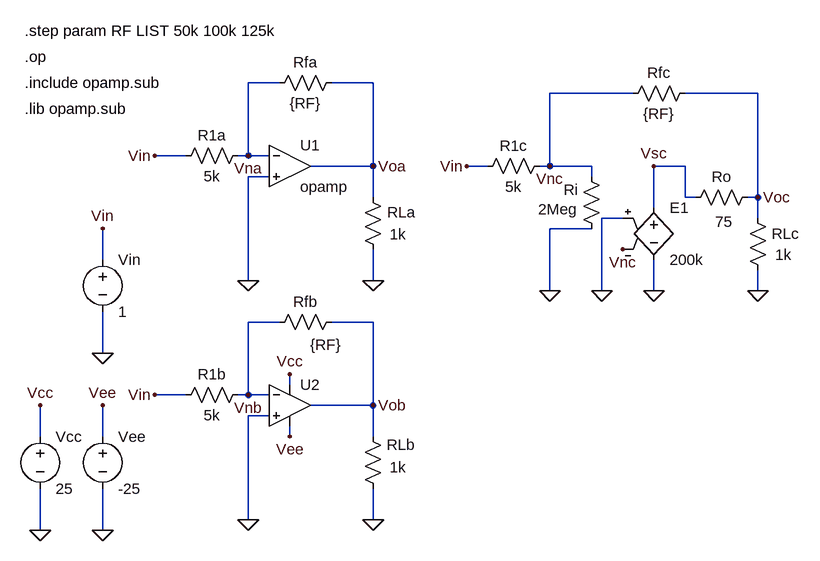
[diagram p0: schematic lab7.asc]
lab7.asc, the LTspice schematic file:
Version 4
SHEET 1 1268 680
WIRE 368 -64 320 -64
WIRE 512 -64 448 -64
WIRE 912 -48 784 -48
WIRE 1104 -48 992 -48
WIRE 224 48 176 48
WIRE 320 48 320 -64
WIRE 320 48 304 48
WIRE 352 48 320 48
WIRE 512 64 512 -64
WIRE 512 64 416 64
WIRE 688 64 656 64
WIRE 784 64 784 -48
WIRE 784 64 768 64
WIRE 848 64 784 64
WIRE 992 64 944 64
WIRE 352 80 320 80
WIRE 848 80 848 64
WIRE 512 112 512 64
WIRE 992 112 992 64
WIRE 1008 112 992 112
WIRE 1104 112 1104 -48
WIRE 1104 112 1088 112
WIRE 944 128 944 64
WIRE 896 144 864 144
WIRE 1104 144 1104 112
WIRE 848 160 784 160
WIRE 96 208 96 160
WIRE 320 240 320 80
WIRE 512 240 512 192
WIRE 784 256 784 160
WIRE 864 256 864 144
WIRE 944 256 944 208
WIRE 1104 256 1104 224
WIRE 368 304 320 304
WIRE 512 304 448 304
WIRE 96 352 96 288
WIRE 384 400 384 384
WIRE 224 416 176 416
WIRE 320 416 320 304
WIRE 320 416 304 416
WIRE 352 416 320 416
WIRE 512 432 512 304
WIRE 512 432 416 432
WIRE 352 448 320 448
WIRE 0 480 0 432
WIRE 96 480 96 432
WIRE 384 480 384 464
WIRE 512 480 512 432
WIRE 320 608 320 448
WIRE 512 608 512 560
WIRE 0 624 0 560
WIRE 96 624 96 560
FLAG 96 352 0
FLAG 320 240 0
FLAG 512 240 0
FLAG 96 160 Vin
FLAG 176 48 Vin
FLAG 320 608 0
FLAG 512 608 0
FLAG 176 416 Vin
FLAG 320 48 Vna
FLAG 320 416 Vnb
FLAG 512 64 Voa
FLAG 512 432 Vob
FLAG 96 624 0
FLAG 96 432 Vee
FLAG 0 624 0
FLAG 0 432 Vcc
FLAG 384 384 Vcc
FLAG 384 480 Vee
FLAG 784 256 0
FLAG 1104 256 0
FLAG 944 256 0
FLAG 1104 112 Voc
FLAG 656 64 Vin
FLAG 784 64 Vnc
FLAG 864 256 0
FLAG 896 192 Vnc
FLAG 944 64 Vsc
SYMBOL res 320 32 R90
WINDOW 0 0 56 VBottom 2
WINDOW 3 32 56 VTop 2
SYMATTR InstName R1a
SYMATTR Value 5k
SYMBOL res 464 -80 R90
WINDOW 0 0 56 VBottom 2
WINDOW 3 32 56 VTop 2
SYMATTR InstName Rfa
SYMATTR Value {RF}
SYMBOL res 528 208 R180
WINDOW 0 -50 73 Left 2
WINDOW 3 -35 39 Left 2
SYMATTR InstName RLa
SYMATTR Value 1k
SYMBOL voltage 96 192 R0
SYMATTR InstName Vin
SYMATTR Value 1
SYMBOL res 320 400 R90
WINDOW 0 0 56 VBottom 2
WINDOW 3 32 56 VTop 2
SYMATTR InstName R1b
SYMATTR Value 5k
SYMBOL res 464 288 R90
WINDOW 0 0 56 VBottom 2
WINDOW 3 35 24 VTop 2
SYMATTR InstName Rfb
SYMATTR Value {RF}
SYMBOL res 528 576 R180
WINDOW 0 -49 83 Left 2
WINDOW 3 -35 49 Left 2
SYMATTR InstName RLb
SYMATTR Value 1k
SYMBOL voltage 96 464 R0
SYMATTR InstName Vee
SYMATTR Value -25
SYMBOL voltage 0 464 R0
SYMATTR InstName Vcc
SYMATTR Value 25
SYMBOL Opamps/opamp 384 0 R0
SYMATTR InstName U1
SYMBOL Opamps/UniversalOpamp2 384 432 R0
SYMATTR InstName U2
SYMATTR SpiceModel level.1
SYMATTR SpiceLine ilimit=50m rail=0 Vos=0 phimargin=45
SYMBOL res 784 48 R90
WINDOW 0 0 56 VBottom 2
WINDOW 3 32 56 VTop 2
SYMATTR InstName R1c
SYMATTR Value 5k
SYMBOL res 1008 -64 R90
WINDOW 0 0 56 VBottom 2
WINDOW 3 32 56 VTop 2
SYMATTR InstName Rfc
SYMATTR Value {RF}
SYMBOL res 1120 240 R180
WINDOW 0 -48 72 Left 2
WINDOW 3 -36 40 Left 2
SYMATTR InstName RLc
SYMATTR Value 1k
SYMBOL res 864 176 R180
WINDOW 0 36 76 Left 2
WINDOW 3 37 46 Left 2
SYMATTR InstName Ri
SYMATTR Value 2Meg
SYMBOL res 992 128 R270
WINDOW 0 32 56 VTop 2
WINDOW 3 -6 60 VBottom 2
SYMATTR InstName Ro
SYMATTR Value 75
SYMBOL e 944 112 R0
SYMATTR InstName E1
SYMATTR Value 200k
TEXT -24 -104 Left 2 !.op
TEXT -24 -64 Left 2 !.include opamp.sub
TEXT -24 -144 Left 2 !.step param RF LIST 50k 100k 125k
TEXT -24 -24 Left 2 !.lib opamp.sub

The netlist it stands for:
* lab7.asc
R1a Vna Vin 5k
Rfa Voa Vna {RF}
RLa 0 Voa 1k
Vin Vin 0 1
R1b Vnb Vin 5k
Rfb Vob Vnb {RF}
RLb 0 Vob 1k
Vee Vee 0 -25
Vcc Vcc 0 25
XU1 Vna 0 Voa opamp Aol=100K GBW=10Meg  ; pins invin noninvin out
XU2 0 Vnb Vcc Vee Vob level.1 Avol=1Meg GBW=10Meg Slew=10Meg ilimit=50m rail=0 Vos=0 phimargin=45 en=0 enk=0 in=0 ink=0 Rin=500Meg  ; pins IN+ IN- V+ V- OUT
R1c Vnc Vin 5k
Rfc Voc Vnc {RF}
RLc 0 Voc 1k
Ri 0 Vnc 2Meg
Ro Vsc Voc 75
E1 Vsc 0 0 Vnc 200k
.op
.include opamp.sub
.step param RF LIST 50k 100k 125k
.lib opamp.sub
.lib UniversalOpamps2.sub
.backanno
.end